# Altium schematic sheet Potentiometers.SchDoc
size A2; SheetNumber: 10; SheetTotal: 13
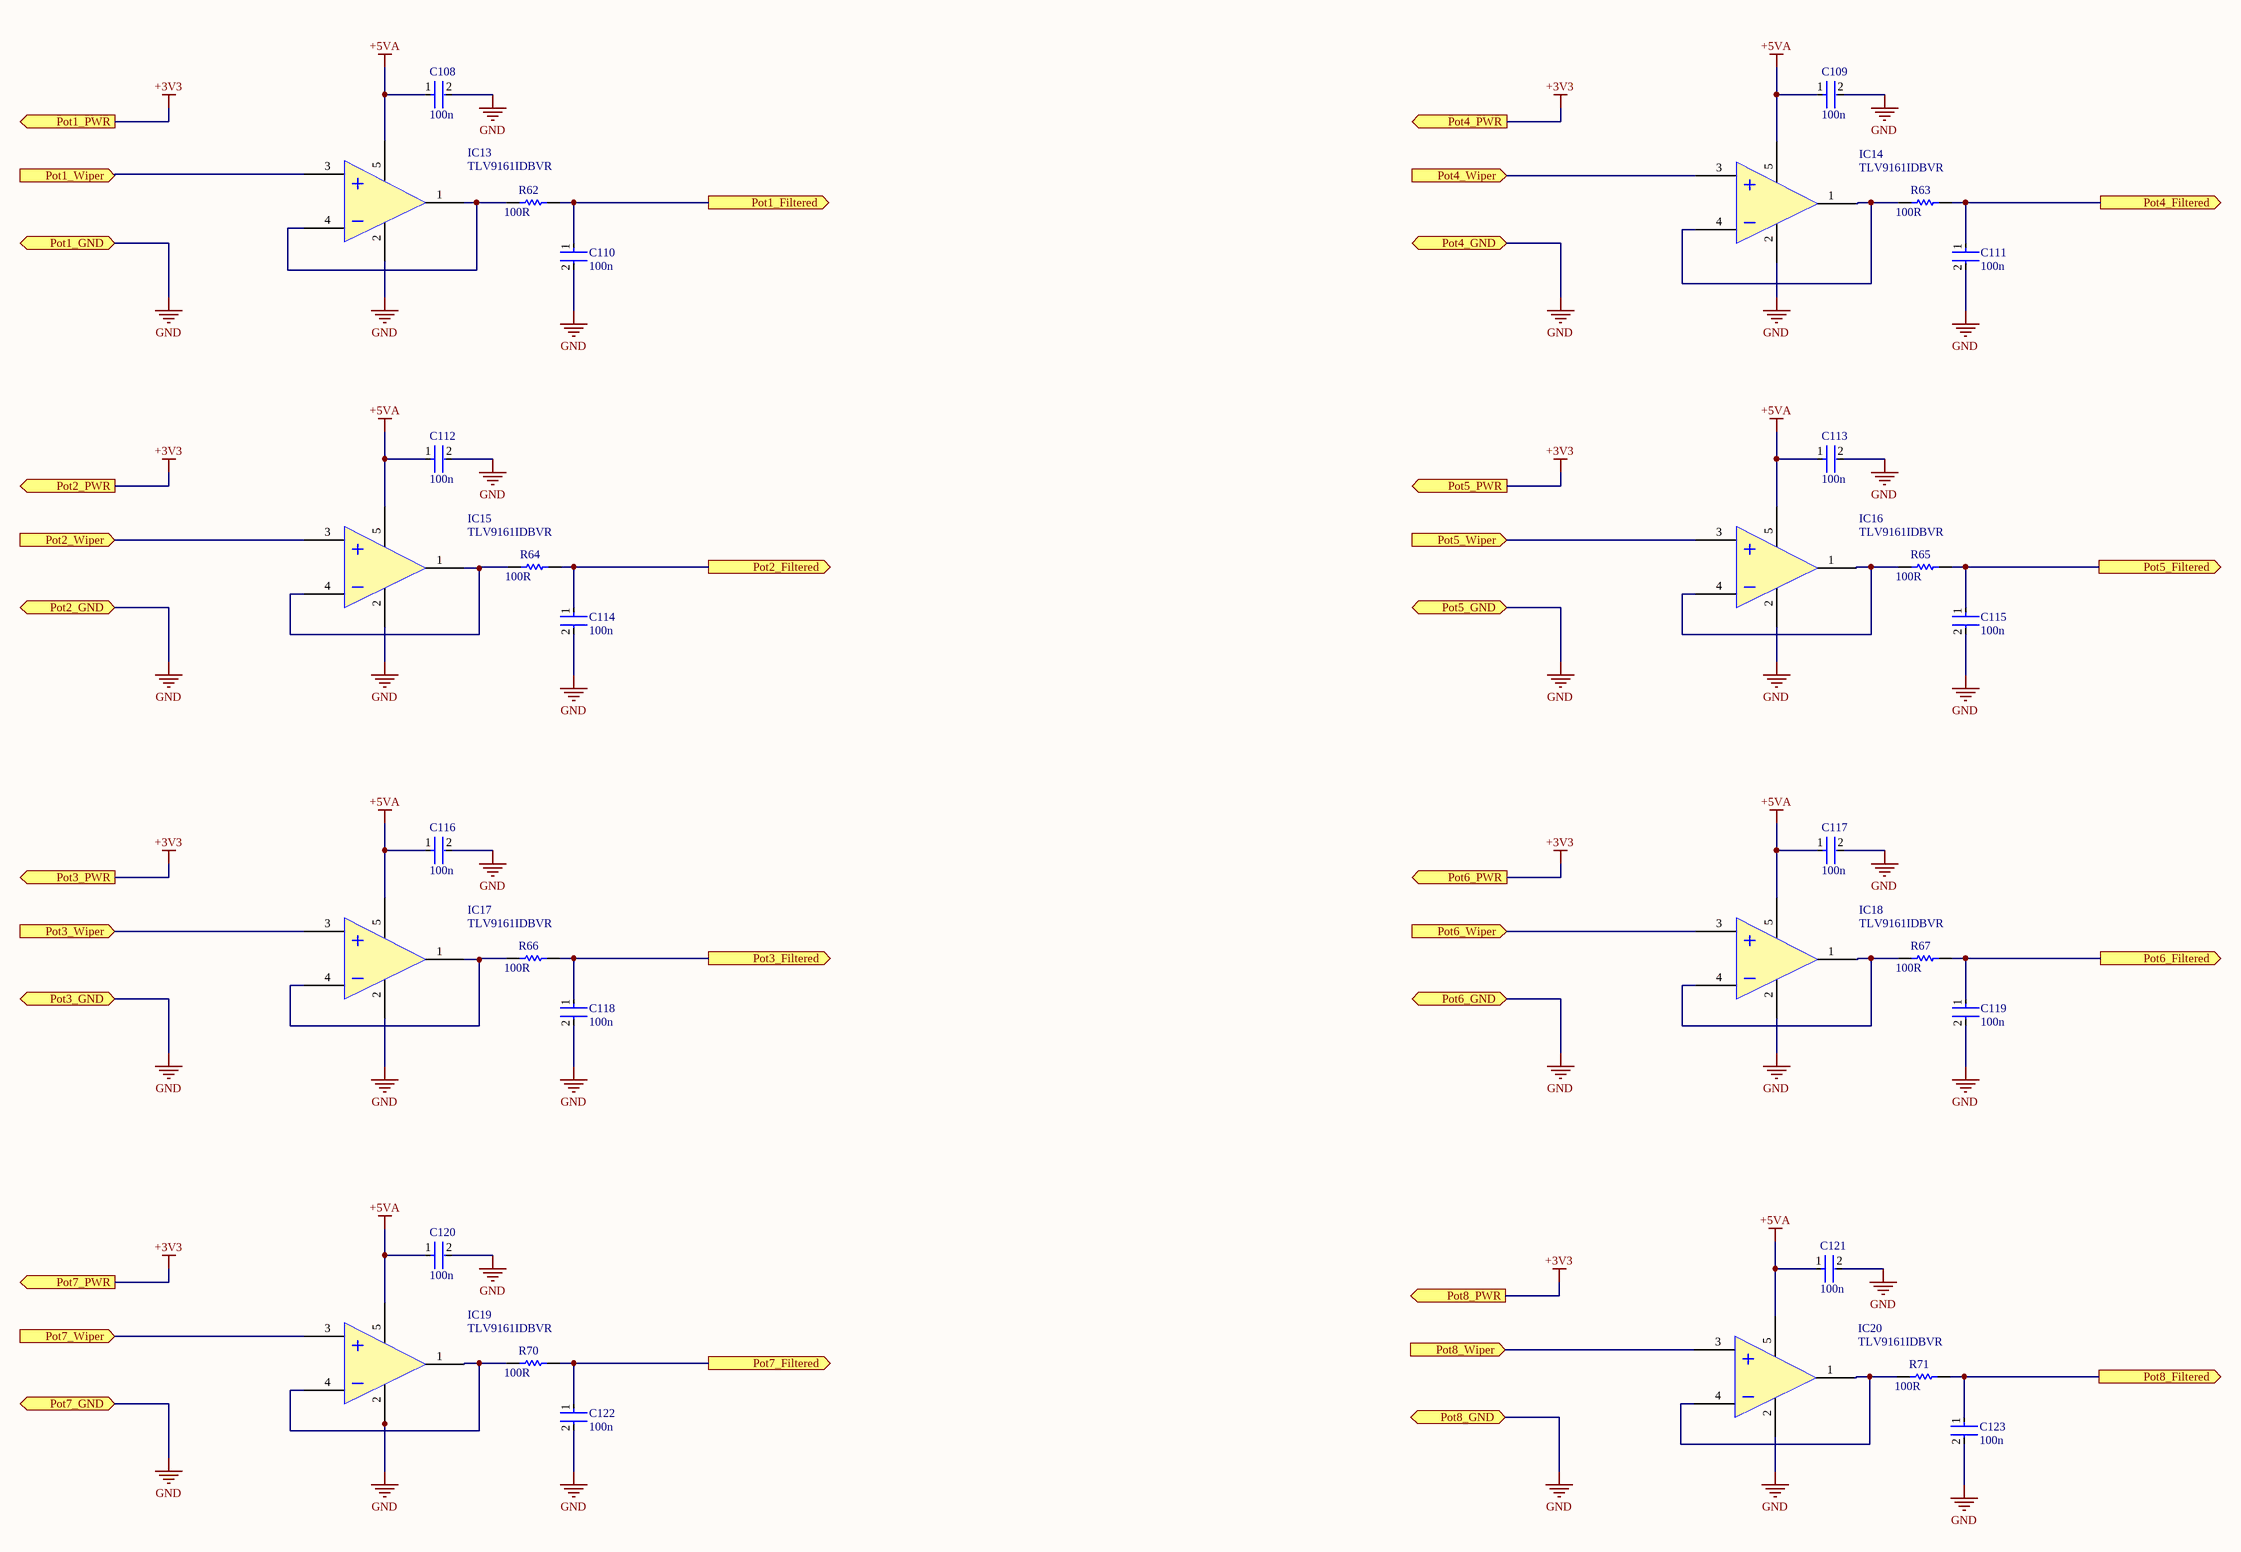
[diagram p0: Potentiometers.SchDoc]

## Parts
C108  Capacitance: 100n  [FP-GCM155-0_05-IPC_A]  (hidden comment: GCM155R71H104ME02J)
C109  Capacitance: 100n  [FP-GCM155-0_05-IPC_A]  (hidden comment: GCM155R71H104ME02J)
C110  Capacitance: 100n  [FP-GCM155-0_05-IPC_A]  (hidden comment: GCM155R71H104ME02J)
C111  Capacitance: 100n  [FP-GCM155-0_05-IPC_A]  (hidden comment: GCM155R71H104ME02J)
C112  Capacitance: 100n  [FP-GCM155-0_05-IPC_A]  (hidden comment: GCM155R71H104ME02J)
C113  Capacitance: 100n  [FP-GCM155-0_05-IPC_A]  (hidden comment: GCM155R71H104ME02J)
C114  Capacitance: 100n  [FP-GCM155-0_05-IPC_A]  (hidden comment: GCM155R71H104ME02J)
C115  Capacitance: 100n  [FP-GCM155-0_05-IPC_A]  (hidden comment: GCM155R71H104ME02J)
C116  Capacitance: 100n  [FP-GCM155-0_05-IPC_A]  (hidden comment: GCM155R71H104ME02J)
C117  Capacitance: 100n  [FP-GCM155-0_05-IPC_A]  (hidden comment: GCM155R71H104ME02J)
C118  Capacitance: 100n  [FP-GCM155-0_05-IPC_A]  (hidden comment: GCM155R71H104ME02J)
C119  Capacitance: 100n  [FP-GCM155-0_05-IPC_A]  (hidden comment: GCM155R71H104ME02J)
C120  Capacitance: 100n  [FP-GCM155-0_05-IPC_A]  (hidden comment: GCM155R71H104ME02J)
C121  Capacitance: 100n  [FP-GCM155-0_05-IPC_A]  (hidden comment: GCM155R71H104ME02J)
C122  Capacitance: 100n  [FP-GCM155-0_05-IPC_A]  (hidden comment: GCM155R71H104ME02J)
C123  Capacitance: 100n  [FP-GCM155-0_05-IPC_A]  (hidden comment: GCM155R71H104ME02J)
IC13  TLV9161IDBVR  [SOT95P280X145-5N]
IC14  TLV9161IDBVR  [SOT95P280X145-5N]
IC15  TLV9161IDBVR  [SOT95P280X145-5N]
IC16  TLV9161IDBVR  [SOT95P280X145-5N]
IC17  TLV9161IDBVR  [SOT95P280X145-5N]
IC18  TLV9161IDBVR  [SOT95P280X145-5N]
IC19  TLV9161IDBVR  [SOT95P280X145-5N]
IC20  TLV9161IDBVR  [SOT95P280X145-5N]
R62  Resistance: 100R  [RESC1005X40X25NL05T10]  (hidden comment: RC0402JR-07100RL)
R63  Resistance: 100R  [RESC1005X40X25NL05T10]  (hidden comment: RC0402JR-07100RL)
R64  Resistance: 100R  [RESC1005X40X25NL05T10]  (hidden comment: RC0402JR-07100RL)
R65  Resistance: 100R  [RESC1005X40X25NL05T10]  (hidden comment: RC0402JR-07100RL)
R66  Resistance: 100R  [RESC1005X40X25NL05T10]  (hidden comment: RC0402JR-07100RL)
R67  Resistance: 100R  [RESC1005X40X25NL05T10]  (hidden comment: RC0402JR-07100RL)
R70  Resistance: 100R  [RESC1005X40X25NL05T10]  (hidden comment: RC0402JR-07100RL)
R71  Resistance: 100R  [RESC1005X40X25NL05T10]  (hidden comment: RC0402JR-07100RL)

## Ports
Pot1_Filtered (out, see high_level[4C], MCU_Connections[6C]), Pot1_GND (bidir, see high_level[5C], Peripherals[2C]), Pot1_PWR (out, see high_level[5C], Peripherals[2C]), Pot1_Wiper (in, see high_level[5C], Peripherals[2C]), Pot2_Filtered (out, see high_level[4C], MCU_Connections[6C]), Pot2_GND (bidir, see high_level[5C], Peripherals[2C]), Pot2_PWR (out, see high_level[5C], Peripherals[2C]), Pot2_Wiper (in, see high_level[5C], Peripherals[2C]), Pot3_Filtered (out, see high_level[4C], MCU_Connections[6C]), Pot3_GND (bidir, see high_level[5C], Peripherals[2C]), Pot3_PWR (out, see high_level[5C], Peripherals[2C]), Pot3_Wiper (in, see high_level[5C], Peripherals[2C]), Pot4_Filtered (out, see high_level[4C], MCU_Connections[6C]), Pot4_GND (bidir, see high_level[5C], Peripherals[2C]), Pot4_PWR (out, see high_level[5C], Peripherals[2C]), Pot4_Wiper (in, see high_level[5C], Peripherals[2C]), Pot5_Filtered (out, see high_level[4C], MCU_Connections[6C]), Pot5_GND (bidir, see high_level[5C], Peripherals[3C]), Pot5_PWR (out, see high_level[5C], Peripherals[2C]), Pot5_Wiper (in, see high_level[5C], Peripherals[3C]), Pot6_Filtered (out, see high_level[4C], MCU_Connections[6C]), Pot6_GND (bidir, see high_level[5C], Peripherals[3C]), Pot6_PWR (out, see high_level[5C], Peripherals[3C]), Pot6_Wiper (in, see high_level[5C], Peripherals[3C]), Pot7_Filtered (out, see high_level[4C], MCU_Connections[6C]), Pot7_GND (bidir, see high_level[5C], Peripherals[3C]), Pot7_PWR (out, see high_level[5C], Peripherals[3C]), Pot7_Wiper (in, see high_level[5C], Peripherals[3C]), Pot8_Filtered (out, see high_level[4C], MCU_Connections[6C]), Pot8_GND (bidir, see high_level[5C], Peripherals[3C]), Pot8_PWR (out, see high_level[5C], Peripherals[3C]), Pot8_Wiper (in, see high_level[5C], Peripherals[3C])

## Nets
+3V3: port Pot1_PWR, port Pot2_PWR, port Pot3_PWR, port Pot4_PWR, port Pot5_PWR, port Pot6_PWR, port Pot7_PWR, port Pot8_PWR
+5VA: C108.1 C109.1 C112.1 C113.1 C116.1 C117.1 C120.1 C121.1 IC13.5(V+) IC14.5(V+) IC15.5(V+) IC16.5(V+) IC17.5(V+) IC18.5(V+) IC19.5(V+) IC20.5(V+)
GND: C108.2 C109.2 C110.2 C111.2 C112.2 C113.2 C114.2 C115.2 C116.2 C117.2 C118.2 C119.2 C120.2 C121.2 C122.2 C123.2 IC13.2(V-) IC14.2(V-) IC15.2(V-) IC16.2(V-) IC17.2(V-) IC18.2(V-) IC19.2(V-) IC20.2(V-) ; port Pot1_GND, port Pot2_GND, port Pot3_GND, port Pot4_GND, port Pot5_GND, port Pot6_GND, port Pot7_GND, port Pot8_GND
Pot1_Filtered: C110.1 R62.2 ; port Pot1_Filtered
Pot1_Wiper: IC13.3(IN+) ; port Pot1_Wiper
Pot2_Filtered: C114.1 R64.2 ; port Pot2_Filtered
Pot2_Wiper: IC15.3(IN+) ; port Pot2_Wiper
Pot3_Filtered: C118.1 R66.2 ; port Pot3_Filtered
Pot3_Wiper: IC17.3(IN+) ; port Pot3_Wiper
Pot4_Filtered: C111.1 R63.2 ; port Pot4_Filtered
Pot4_Wiper: IC14.3(IN+) ; port Pot4_Wiper
Pot5_Filtered: C115.1 R65.2 ; port Pot5_Filtered
Pot5_Wiper: IC16.3(IN+) ; port Pot5_Wiper
Pot6_Filtered: C119.1 R67.2 ; port Pot6_Filtered
Pot6_Wiper: IC18.3(IN+) ; port Pot6_Wiper
Pot7_Filtered: C122.1 R70.2 ; port Pot7_Filtered
Pot7_Wiper: IC19.3(IN+) ; port Pot7_Wiper
Pot8_Filtered: C123.1 R71.2 ; port Pot8_Filtered
Pot8_Wiper: IC20.3(IN+) ; port Pot8_Wiper
NetIC13_1: IC13.1(OUT) IC13.4(IN-) R62.1
NetIC14_1: IC14.1(OUT) IC14.4(IN-) R63.1
NetIC15_1: IC15.1(OUT) IC15.4(IN-) R64.1
NetIC16_1: IC16.1(OUT) IC16.4(IN-) R65.1
NetIC17_1: IC17.1(OUT) IC17.4(IN-) R66.1
NetIC18_1: IC18.1(OUT) IC18.4(IN-) R67.1
NetIC19_1: IC19.1(OUT) IC19.4(IN-) R70.1
NetIC20_1: IC20.1(OUT) IC20.4(IN-) R71.1

## Library data of the parts
C108-C123 = CMP-06035-028957-1: Ceramic Capacitor for Automotive 100nF ±20% 50VDC X7R 0402 Paper T/R
IC13-IC20 = TLV9161IDBVR: Integrated Circuit; Manufacturer_Name: Texas Instruments; Datasheet Link: https://www.ti.com/lit/ds/symlink/tlv9161.pdf?HQS=dis-mous-null-mousermode-dsf-pf-null-wwe&ts=1675947383550&ref_url=https%253A%252F%252Fwww.mouser.de%252F; Height: 1.45mm; Manufacturer_Part_Number: TLV9161IDBVR; Mouser Part Number: 595-TLV9161IDBVR; Mouser Price/Stock: https://www.mouser.co.uk/ProductDetail/Texas-Instruments/TLV9161IDBVR?qs=Rp5uXu7WBW%2FkWJAGvxG3xQ%3D%3D; Arrow Part Number: TLV9161IDBVR; Arrow Price/Stock: https://www.arrow.com/en/products/tlv9161idbvr/texas-instruments?utm_currency=USD&region=nac
R62-R67 R70 R71 = CMP-2002-07914-1: Manufacturer: Yageo / Phycomp; Part Number: RC0402JR-07100RL